# Altium schematic sheet 795494688IHM08M1-DG_V4.SchDoc
size A4
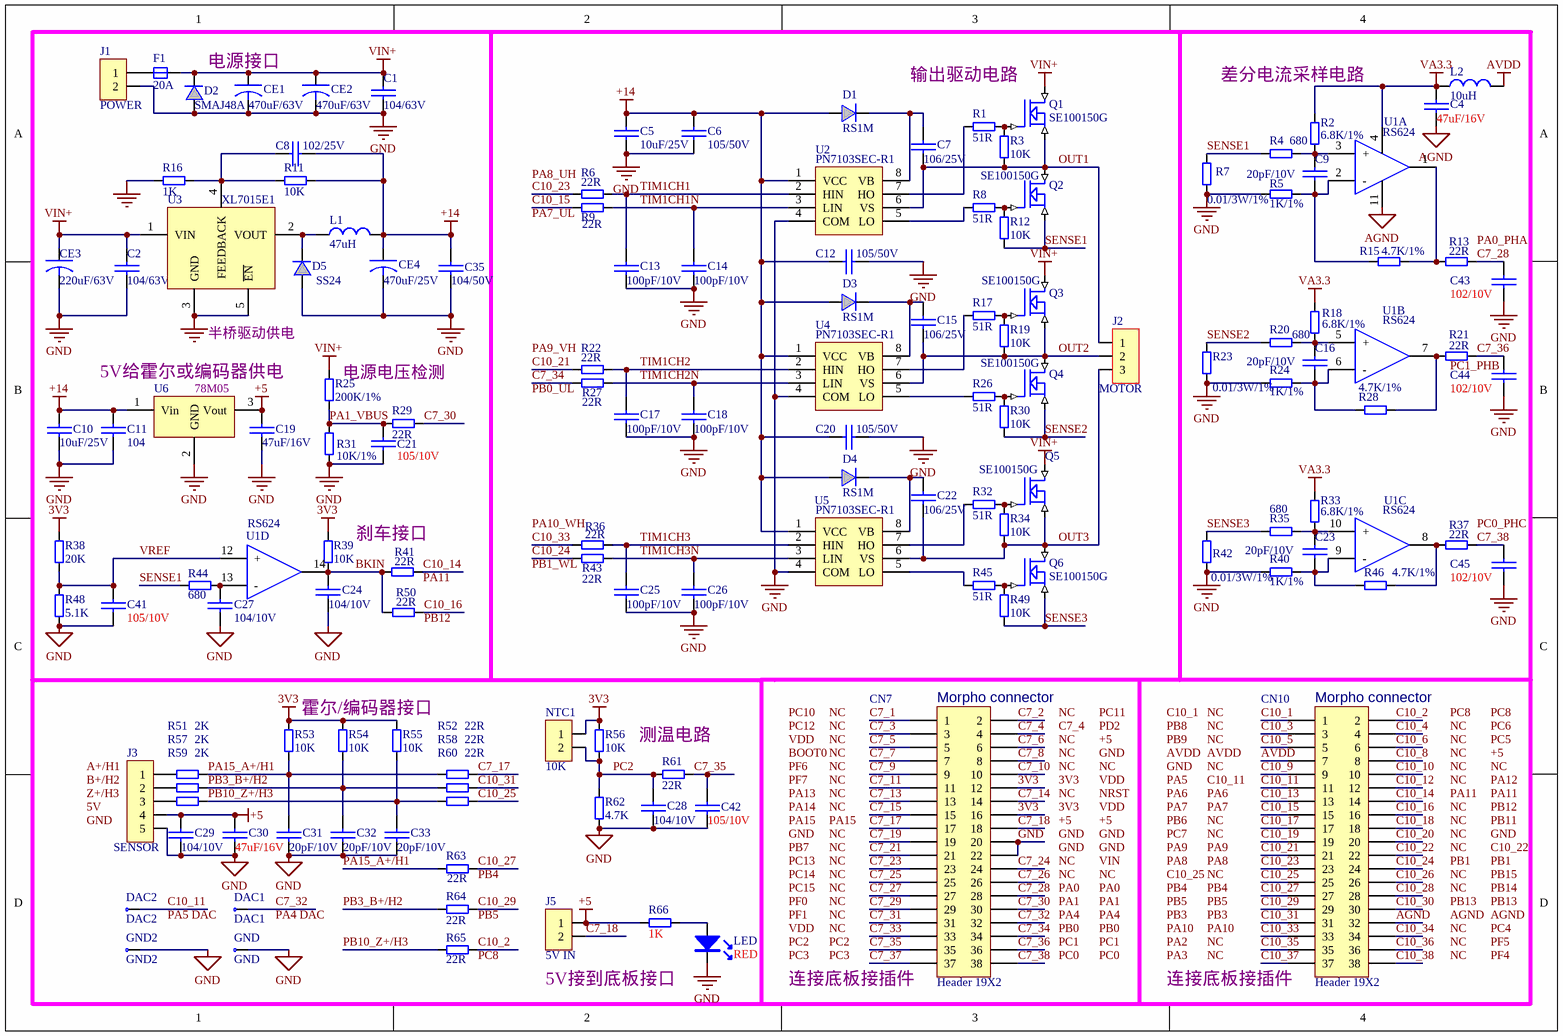
[diagram p0: 795494688IHM08M1-DG_V4.SchDoc]

## Parts
C1  104/63V  [0805C]
C2  104/63V  [0805C]
C4  47uF/16V  [0805C]
C5  10uF/25V  [1206C]
C6  105/50V  [0805C]
C7  106/25V  [1206C]
C8  102/25V  [0805C]
C9  20pF/10V  [0603C]
C10  10uF/25V  [1206C]
C11  104  [0805C]
C12  105/50V  [0805C]
C13  100pF/10V  [0603C]
C14  100pF/10V  [0603C]
C15  106/25V  [1206C]
C16  20pF/10V  [0603C]
C17  100pF/10V  [0603C]
C18  100pF/10V  [0603C]
C19  47uF/16V  [1206C]
C20  105/50V  [0805C]
C21  105/10V  [0603C]
C22  106/25V  [1206C]
C23  20pF/10V  [0603C]
C24  104/10V  [0603C]
C25  100pF/10V  [0603C]
C26  100pF/10V  [0603C]
C27  104/10V  [0603C]
C28  104/10V  [0603C]
C29  104/10V  [0603C]
C30  47uF/16V  [0805C]
C31  20pF/10V  [0603C]
C32  20pF/10V  [0603C]
C33  20pF/10V  [0603C]
C35  104/50V  [0805C]
C41  105/10V  [0603C]
C42  105/10V  [0603C]
C43  102/10V  [0603C]
C44  102/10V  [0603C]
C45  102/10V  [0603C]
CE1  470uF/63V  [E5-12.5]
CE2  470uF/63V  [E5-12.5]
CE3  220uF/63V  [E5-10]
CE4  470uF/25V  [E3.5-8.2]
CN7  Header 19X2  [2*19P]
CN10  Header 19X2  [2*19P]
D1  RS1M  [TP4007]
D2  SMAJ48A  [TPss24]
D3  RS1M  [TP4007]
D4  RS1M  [TP4007]
D5  SS24  [TPss24]
DAC1  DAC1  [TP-1.5]
DAC2  DAC2  [TP-1.5]
F1  20A  [F1808]
GND  GND  [TP-1.5]
GND2  GND2  [TP-1.5]
J1  POWER  [POW-5.08-2W]
J2  MOTOR  [POW-5.08-3W]
J3  SENSOR  [SIP5]
J5  5V IN  [SIP2]
L1  47uH  [L-TB-7*7]
L2  10uH  [0603]
LED  RED  [0603D]
NTC1  10K  [SIP2]
Q1  SE100150G  [TO-263S]
Q2  SE100150G  [TO-263S]
Q3  SE100150G  [TO-263S]
Q4  SE100150G  [TO-263S]
Q5  SE100150G  [TO-263S]
Q6  SE100150G  [TO-263S]
R1  51R  [0805]
R2  6.8K/1%  [0603]
R3  10K  [0603]
R4  680  [0603]
R5  1K/1%  [0603]
R6  22R  [0603]
R7  0.01/3W/1%  [2512]
R8  51R  [0805]
R9  22R  [0603]
R11  10K  [0603]
R12  10K  [0603]
R13  22R  [0603]
R15  4.7K/1%  [0603]
R16  1K  [0603]
R17  51R  [0805]
R18  6.8K/1%  [0603]
R19  10K  [0603]
R20  680  [0603]
R21  22R  [0603]
R22  22R  [0603]
R23  0.01/3W/1%  [2512]
R24  1K/1%  [0603]
R25  200K/1%  [0603]
R26  51R  [0805]
R27  22R  [0603]
R28  4.7K/1%  [0603]
R29  22R  [0603]
R30  10K  [0603]
R31  10K/1%  [0603]
R32  51R  [0805]
R33  6.8K/1%  [0603]
R34  10K  [0603]
R35  680  [0603]
R36  22R  [0603]
R37  22R  [0603]
R38  20K  [0603]
R39  10K  [0603]
R40  1K/1%  [0603]
R41  22R  [0603]
R42  0.01/3W/1%  [2512]
R43  22R  [0603]
R44  680  [0603]
R45  51R  [0805]
R46  4.7K/1%  [0603]
R48  5.1K  [0603]
R49  10K  [0603]
R50  22R  [0603]
R51  2K  [0603]
R52  22R  [0603]
R53  10K  [0603]
R54  10K  [0603]
R55  10K  [0603]
R56  10K  [0805]
R57  2K  [0603]
R58  22R  [0603]
R59  2K  [0603]
R60  22R  [0603]
R61  22R  [0603]
R62  4.7K  [0603]
R63  22R  [0603]
R64  22R  [0603]
R65  22R  [0603]
R66  1K  [0603]
U1  RS624  [SO-14]  (parts A,B,C,D of 4)
U2  PN7103SEC-R1  [SO-8]
U3  XL7015E1  [TO-252-5L]
U4  PN7103SEC-R1  [SO-8]
U5  PN7103SEC-R1  [SO-8]
U6  78M05  [TO-252AA]

## Nets
3V3: CN7.12 CN7.16 NTC1.1 R38.2 R39.2 R53.2 R54.2 R55.2 R56.2
+5: C19.2 C29.1 C30.1 J3.4 J5.1 R66.2 U6.3(Vout)
+14: C5.2 C6.1 C8.1 C10.2 C11.2 C12.1 C20.1 C35.1 CE4.1 D1.A D3.A D4.A L1.2 R11.2 U2.1(VCC) U4.1(VCC) U5.1(VCC) U6.1(Vin)
AGND: C4.2 CN10.32 U1.11(V-)
AVDD: CN10.7 L2.2
GND: C1.2 C2.2 C5.1 C6.2 C10.1 C11.1 C12.2 C13.2 C14.2 C17.2 C18.2 C19.1 C20.2 C21.2 C24.2 C25.2 C26.2 C27.2 C28.2 C29.2 C30.2 C31.2 C32.2 C33.2 C35.2 C41.2 C42.2 C43.2 C44.2 C45.2 CE1.2 CE2.2 CE3.2 CE4.2 CN7.20 CN7.22 D2.A D5.A GND.1 GND2.1 J1.2 J3.5 LED.K R5.1 R7.1 R16.1 R23.1 R24.1 R31.1 R40.1 R42.1 R48.1 R62.1 U2.4(COM) U3.3(GND) U3.5(~{EN}) U4.4(COM) U5.4(COM) U6.2(GND)
VA3.3: C4.1 L2.1 R2.2 R18.2 R33.2 U1.4(V+)
VIN+: C1.1 C2.1 CE1.1 CE2.1 CE3.1 D2.K F1.2 Q1.2(D) Q3.2(D) Q5.2(D) R25.2 U3.1(VIN)
BKIN: C24.1 R39.1 R41.1 R50.1 U1.14(O)
C7_1: CN7.1
C7_2: CN7.2
C7_3: CN7.3
C7_4: CN7.4
C7_5: CN7.5
C7_6: CN7.6
C7_7: CN7.7
C7_8: CN7.8
C7_9: CN7.9
C7_10: CN7.10
C7_11: CN7.11
C7_13: CN7.13
C7_14: CN7.14
C7_15: CN7.15
C7_17: CN7.17 R52.1
C7_18: CN7.18 J5.2
C7_19: CN7.19
C7_21: CN7.21
C7_23: CN7.23
C7_24: CN7.24
C7_25: CN7.25
C7_26: CN7.26
C7_27: CN7.27
C7_28: C43.1 CN7.28 R13.2
C7_29: CN7.29
C7_30: CN7.30 R29.2
C7_31: CN7.31
C7_32: CN7.32 DAC1.1
C7_33: CN7.33
C7_34: CN7.34 R27.1
C7_35: C42.1 CN7.35 R61.1
C7_36: C44.1 CN7.36 R21.2
C7_37: CN7.37
C7_38: C45.1 CN7.38 R37.2
C10_1: CN10.1
C10_2: CN10.2 R65.1
C10_3: CN10.3
C10_4: CN10.4
C10_5: CN10.5
C10_6: CN10.6
C10_8: CN10.8
C10_9: CN10.9
C10_10: CN10.10
C10_11: CN10.11 DAC2.1
C10_12: CN10.12
C10_13: CN10.13
C10_14: CN10.14 R41.2
C10_15: CN10.15 R9.1
C10_16: CN10.16 R50.2
C10_17: CN10.17
C10_18: CN10.18
C10_19: CN10.19
C10_20: CN10.20
C10_21: CN10.21 R22.1
C10_22: CN10.22
C10_23: CN10.23 R6.1
C10_24: CN10.24 R43.1
C10_25: CN10.25 R60.1
C10_26: CN10.26
C10_27: CN10.27 R63.1
C10_28: CN10.28
C10_29: CN10.29 R64.1
C10_30: CN10.30
C10_31: CN10.31 R58.1
C10_33: CN10.33 R36.1
C10_34: CN10.34
C10_35: CN10.35
C10_36: CN10.36
C10_37: CN10.37
C10_38: CN10.38
OUT1: C7.2 J2.1 Q1.3(S) Q2.2(D) R3.1 U2.6(VS)
OUT2: C15.2 J2.2 Q3.3(S) Q4.2(D) R19.1 U4.6(VS)
OUT3: C22.2 J2.3 Q5.3(S) Q6.2(D) R34.1 U5.6(VS)
PA1_VBUS: C21.1 R25.1 R29.1 R31.2
PA15_A+/H1: C31.1 R51.2 R52.2 R53.1 R63.2
PB3_B+/H2: C32.1 R54.1 R57.2 R58.2 R64.2
PB10_Z+/H3: C33.1 R55.1 R59.2 R60.2 R65.2
PC2: C28.1 NTC1.2 R56.1 R61.2 R62.2
SENSE1: Q2.3(S) R4.1 R7.2 R12.1 R44.1
SENSE2: Q4.3(S) R20.1 R23.2 R30.1
SENSE3: Q6.3(S) R35.1 R42.2 R49.1
TIM1CH1: C13.1 R6.2 U2.2(HIN)
TIM1CH1N: C14.1 R9.2 U2.3(LIN)
TIM1CH2: C17.1 R22.2 U4.2(HIN)
TIM1CH2N: C18.1 R27.2 U4.3(LIN)
TIM1CH3: C25.1 R36.2 U5.2(HIN)
TIM1CH3N: C26.1 R43.2 U5.3(LIN)
VREF: C41.1 R38.1 R48.2 U1.12(+)
NetC7_1: C7.1 D1.K U2.8(VB)
NetC8_2: C8.2 R11.1 R16.2 U3.4(FEEDBACK)
NetC9_1: C9.1 R2.1 R4.2 U1.3(+)
NetC9_2: C9.2 R5.2 R15.2 U1.2(-)
NetC15_1: C15.1 D3.K U4.8(VB)
NetC16_1: C16.1 R18.1 R20.2 U1.5(+)
NetC16_2: C16.2 R24.2 R28.2 U1.6(-)
NetC22_1: C22.1 D4.K U5.8(VB)
NetC23_1: C23.1 R33.1 R35.2 U1.10(+)
NetC23_2: C23.2 R40.2 R46.2 U1.9(-)
NetC27_1: C27.1 R44.2 U1.13(-)
NetD5_K: D5.K L1.1 U3.2(VOUT)
NetF1_1: F1.1 J1.1
NetJ3_1: J3.1 R51.1
NetJ3_2: J3.2 R57.1
NetJ3_3: J3.3 R59.1
NetLED_A: LED.A R66.1
NetQ1_1: Q1.1(G) R1.2 R3.2
NetQ2_1: Q2.1(G) R8.2 R12.2
NetQ3_1: Q3.1(G) R17.2 R19.2
NetQ4_1: Q4.1(G) R26.2 R30.2
NetQ5_1: Q5.1(G) R32.2 R34.2
NetQ6_1: Q6.1(G) R45.2 R49.2
NetR1_1: R1.1 U2.7(HO)
NetR8_1: R8.1 U2.5(LO)
NetR13_1: R13.1 R15.1 U1.1(O)
NetR17_1: R17.1 U4.7(HO)
NetR21_1: R21.1 R28.1 U1.7(O)
NetR26_1: R26.1 U4.5(LO)
NetR32_1: R32.1 U5.7(HO)
NetR37_1: R37.1 R46.1 U1.8(O)
NetR45_1: R45.1 U5.5(LO)

## Notes on the sheet
- 电源接口
- 输出驱动电路
- 差分电流采样电路
- 5V给霍尔或编码器供电
- (near U3) 半桥驱动供电
- (near R25) 电源电压检测
- 刹车接口
- 霍尔/编码器接口
- (near CN7) Morpho connector
- (near CN10) Morpho connector
- 测温电路
- (near J5) 5V接到底板接口
- 连接底板接插件
- Labels drawn without touching a wire or pin: 3V3, 5V, +5, A+/H1, AGND, AVDD, B+/H2, BOOT0, C7_4, C10_1, C10_11, C10_22, C10_25, GND, NC, NRST, PA0, PA0_PHA, PA1, PA2, PA3, PA4, PA4 DAC, PA5, PA5 DAC, PA6, PA7, PA7_UL, PA8, PA8_UH, PA9, PA9_VH, PA10, PA10_WH, PA11, PA12, PA13, PA14, PA15, PB0, PB0_UL, PB1, PB1_WL, PB3, PB4, PB5, PB6, PB7, PB8, PB9, PB11, PB12, PB13, PB14, PB15, PC0, PC0_PHC, PC1, PC1_PHB, PC2, PC3, PC4, PC5, PC6, PC7, PC8, PC10, PC11, PC12, PC13, PC14, PC15, PD2, PF0, PF1, PF4, PF5, PF6, PF7, VDD, VIN, Z+/H3

## Library data of the parts
C1 C2 C4 C6 C7 C9 C12-C18 C20-C33 C35 C41-C45 = C
C5 C8 C10 C11 C19 = C: Capacitor; Coding: 41170010
CE1-CE4 = CE: 10uF/25V
CN7 CN10 = Header 19X2: Header, 19-Pin, Dual row; Revision: 17-Jul-2002: Re-released for DXP Platform.; Publisher: Altium Limited
D1-D5 = D
DAC1 DAC2 GND GND2 = TP
F1 = FUSE
J1 J5 NTC1 = CON2: J
J2 = CON3: CN
J3 = CON5: CN
L1 = L: 10uH
L2 = L
LED = LED
Q1-Q6 = MOSFET N
R1 R2 R4-R9 R13 R15-R18 R20-R29 R31-R33 R35-R38 R40-R46 R48 R50-R52 R57-R66 = R: 10K
R3 R11 R12 R19 R30 R34 R39 R49 R53-R56 = R
U1 = LM324
U2 U4 U5 = IR2101S
U3 = XL1507-ADJ
U6 = 7805S: IC